# Altium schematic sheet ADP7157-1V8.SchDoc
size A3
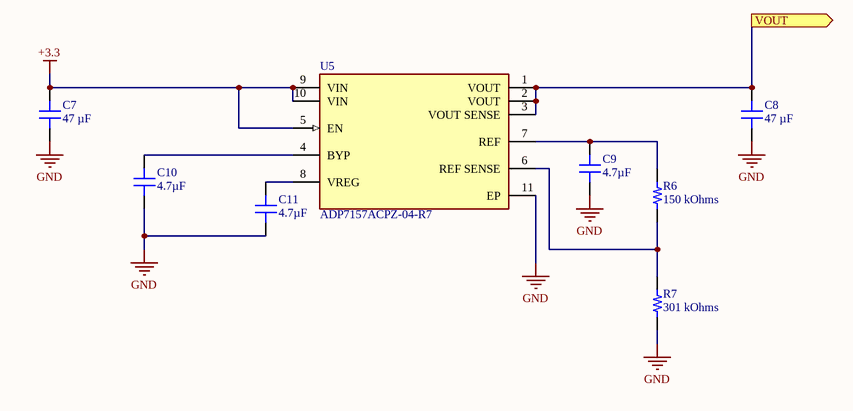
[diagram p0: ADP7157-1V8.SchDoc]

## Parts
C7  47 µF  [CAP 0603_1608]
C8  47 µF  [CAP 0603_1608]
C9  4.7µF  [CAP 0402_1005]
C10  4.7µF  [CAP 0402_1005]
C11  4.7µF  [CAP 0402_1005]
R6  150 kOhms  [RES 0201_0603]
R7  301 kOhms  [RES 0201_0603]
U5  ADP7157ACPZ-04-R7  [FP-CP-10-9-IPC_B]

## Ports
VOUT (out)

## Nets
+3.3: C7.2 U5.5(EN) U5.9(VIN) U5.10(VIN)
GND: C7.1 C8.1 C9.1 C10.1 C11.1 R7.1 U5.11(EP)
VOUT: C8.2 U5.1(VOUT) U5.2(VOUT) U5.3(VOUT_SENSE) ; port VOUT
NetC9_2: C9.2 R6.2 U5.7(REF)
NetC10_2: C10.2 U5.4(BYP)
NetC11_2: C11.2 U5.8(VREG)
NetR6_1: R6.1 R7.2 U5.6(REF_SENSE)

## Library data of the parts
C7 C8 = GRM188R60J476ME01D: CAP CER 47UF 6.3V X5R 0603; manufacturer: Murata Electronics; Tolerance: ±20%; Part Number: GRM188R60J476ME01D; Value: 47 µF; Applications: General Purpose; Capacitance: 47 µF; componentlink2description: DigiKey Link; componentlink2url: https://www.digikey.com/en/products/detail/murata-electronics/GRM188R60J476ME01D/13996874; Device Package: 0603 (1608 Metric); lastupdated: 5/20/2022 2:38:45 PM; Lifecycle Status: Active; Minimum Order: 1; Mounting Type: Surface Mount, MLCC; Operating Temperature: -55°C ~ 85°C; Package / Case: 0603 (1608 Metric); packaging: TapeAndReel; partid: 44498; Part Status: Active; price: 0.10; series: GRM; Size / Dimension: 0.063" L x 0.031" W (1.60mm x 0.80mm); Supplier 1: DigiKey; Supplier Part Number 1: 490-GRM188R60J476ME01DCT-ND; Temperature Coefficient: X5R; Thickness (Max): 0.039" (1.00mm); Voltage - Rated: 6.3V
C9-C11 = GRM155R61A475MEAAD: CAP CER 4.7UF 10V X5R 0402; Manufacturer: Murata Electronics; Tolerance: ±20%; Part Number: GRM155R61A475MEAAD; Value: 4.7µF; Applications: General Purpose; Capacitance: 4.7µF; ComponentLink1Description: Datasheet; ComponentLink1URL: https://search.murata.co.jp/Ceramy/image/img/A01X/G101/ENG/GRM155R61A475MEAA-01.pdf; ComponentLink2Description: DigiKey Link; ComponentLink2URL: https://www.digikey.com/en/products/detail/murata-electronics/GRM155R61A475MEAAD/6234735; Device Package: 0402 (1005 Metric); LastUpdated: 2/8/2022 12:26:50 PM; Lifecycle Status: Active; Minimum Order: 1; Mounting Type: Surface Mount, MLCC; Operating Temperature: -55°C ~ 85°C; Package / Case: 0402 (1005 Metric); Packaging: TapeAndReel; PartId: 6746; Part Status: Active; Price: 0.03; Series: GRM; Size / Dimension: 0.039" L x 0.020" W (1.00mm x 0.50mm); Supplier 1: DigiKey; Supplier Part Number 1: 490-14306-1-ND; Temperature Coefficient: X5R; Thickness (Max): 0.026" (0.65mm); Voltage - Rated: 10V
R6 = ERJ-1GNJ154C: RES SMD 150K OHM 5% 1/20W 0201; Manufacturer: Panasonic Electronic Components; Power (Watts): 0.05W, 1/20W; Temperature Coefficient: ±200ppm/°C; Part Number: ERJ-1GNJ154C; Value: 150 kOhms; ComponentLink1Description: Datasheet; ComponentLink1URL: https://b2b-api.panasonic.eu/file_stream/pids/fileversion/1242; ComponentLink2Description: DigiKey Link; ComponentLink2URL: https://www.digikey.com/en/products/detail/panasonic-electronic-components/ERJ-1GNJ154C/2035839; Composition: Thick Film; Device Package: 0201 (0603 Metric); Features: Automotive AEC-Q200; Height - Seated (Max): 0.010" (0.26mm); LastUpdated: 8/11/2022 9:03:25 AM; Lifecycle Status: Active; Minimum Order: 1; Number of Terminations: 2; Operating Temperature: -55°C ~ 125°C; Package / Case: 0201 (0603 Metric); Packaging: CutTape; PartId: 332; Part Status: Active; Price: 0.01; Ratings: AEC-Q200; Resistance: 150 kOhms; Series: ERJ-1GN; Size / Dimension: 0.024" L x 0.012" W (0.60mm x 0.30mm); Supplier 1: DigiKey; Supplier Part Number 1: P123248CT-ND; Supplier Device Package: 0201; Tolerance: ±5%
R7 = ERJ-1GNF3013C: RES SMD 301K OHM 1% 1/20W 0201; Manufacturer: Panasonic Electronic Components; Power (Watts): 0.05W, 1/20W; Temperature Coefficient: ±200ppm/°C; Part Number: ERJ-1GNF3013C; Value: 301 kOhms; ComponentLink1Description: Datasheet; ComponentLink1URL: https://industrial.panasonic.com/cdbs/www-data/pdf/RDA0000/AOA0000C304.pdf; ComponentLink2Description: DigiKey Link; ComponentLink2URL: https://www.digikey.com/en/products/detail/panasonic-electronic-components/ERJ-1GNF3013C/2036394; Composition: Thick Film; Device Package: 0201 (0603 Metric); Features: Automotive AEC-Q200; Height - Seated (Max): 0.010" (0.26mm); LastUpdated: 8/11/2022 9:03:12 AM; Lifecycle Status: Active; Minimum Order: 1; Number of Terminations: 2; Operating Temperature: -55°C ~ 125°C; Package / Case: 0201 (0603 Metric); Packaging: TapeAndReel; PartId: 2352; Part Status: Active; Price: 0.01; Ratings: AEC-Q200; Resistance: 301 kOhms; Series: ERJ-1GN; Size / Dimension: 0.024" L x 0.012" W (0.60mm x 0.30mm); Supplier 1: DigiKey; Supplier Part Number 1: P122918CT-ND; Supplier Device Package: 0201; Tolerance: ±1%
U5 = CMP-019-00054-1: LDO Regulator Pos 1.2V to 3.3V 1.2A 10-Pin LFCSP EP T/R